# Altium schematic sheet GeneratedSystem-06.SchDoc
size 186 x 83 mm
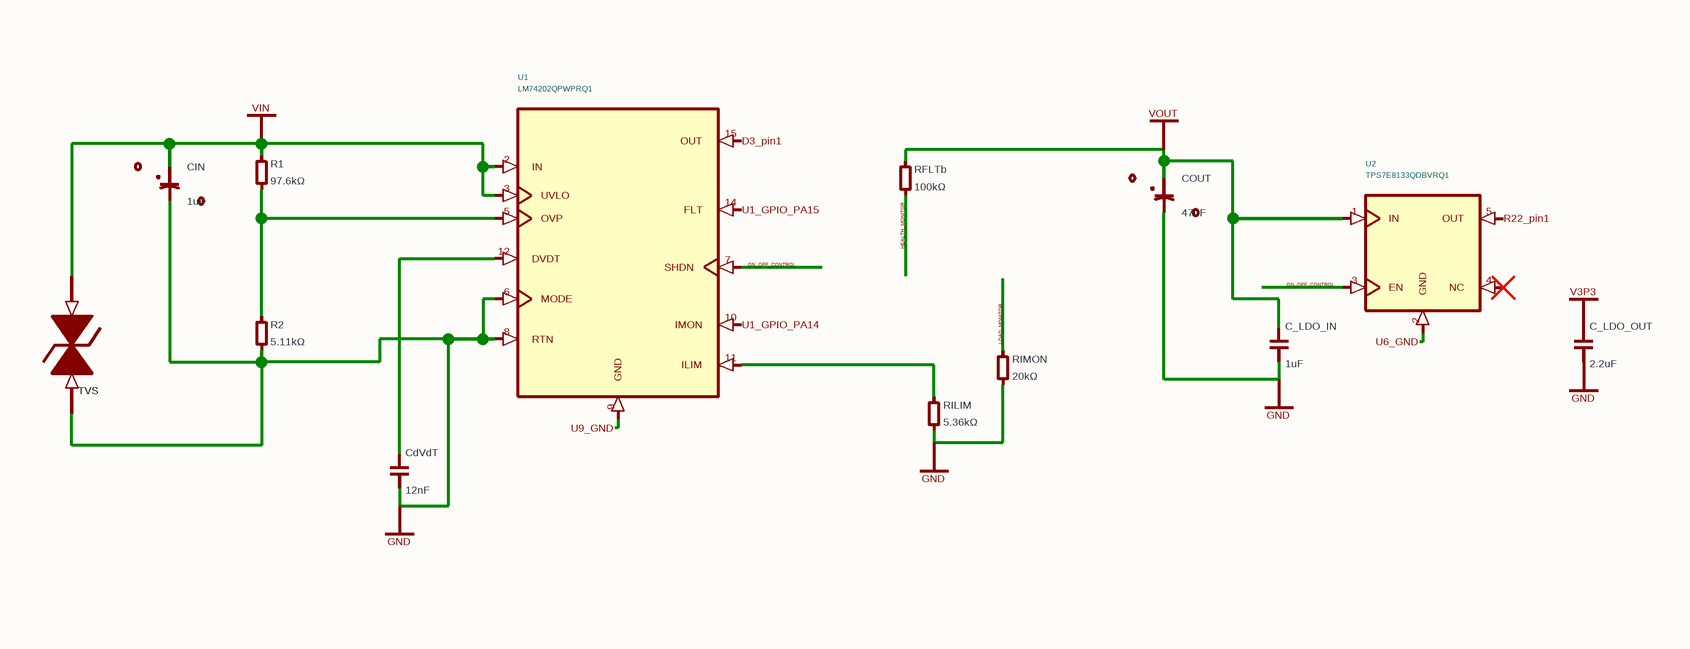
[diagram p0: GeneratedSystem-06.SchDoc]

## Parts
C_LDO_IN  1uF
C_LDO_OUT  2.2uF
CdVdT  12nF
CIN  1uF
COUT  47uF
R1  97.6kΩ
R2  5.11kΩ
RFLTb  100kΩ
RILIM  5.36kΩ
RIMON  20kΩ
TVS  (no value)
U1  (no value)
U2  (no value)

## Nets
GND: C_LDO_IN.2(cathode) C_LDO_OUT.2(cathode) CdVdT.2(cathode) CIN.2(neg) COUT.2(neg) R2.2(cathode) RILIM.2(cathode) RIMON.2(cathode) TVS.1(pin1) U1.6(MODE) U1.8(RTN)
V3P3: C_LDO_OUT.1(anode)
VIN: CIN.1(pos) R1.1(anode) TVS.2(pin2) U1.2(IN) U1.3(UVLO)
VOUT: C_LDO_IN.1(anode) COUT.1(pos) RFLTb.1(anode) U2.1(IN)
D3_pin1: U1.15(OUT)
R22_pin1: U2.5(OUT)
U1_GPIO_PA14: U1.10(IMON)
U1_GPIO_PA15: U1.14(FLT)
U6_GND: U2.2(GND)
U9_GND: U1.9(GND)
NetCdVdT_1: CdVdT.1(anode) U1.12(DVDT)
NetR1_2: R1.2(cathode) R2.1(anode) U1.5(OVP)
NetRILIM_1: RILIM.1(anode) U1.11(ILIM)

Not connected (* = marked no-connect by the designer): RFLTb 2(cathode); RIMON 1(anode); U1 7(SHDN); U2 3(EN) 4(NC)*

## Notes on the sheet
- (near U1) ON_OFF_CONTROL
- (near RFLTb) HEALTH_MONITOR
- (near U2) ON_OFF_CONTROL
- (near RIMON) LOAD_MONITOR
- (in symbol U1) LM74202QPWPRQ1
- (in symbol U2) TPS7E8133QDBVRQ1

## Library data of the parts
C_LDO_IN C_LDO_OUT CdVdT = capacitor_down
CIN COUT = capacitor_polarized_down
R1 R2 RFLTb RILIM RIMON = boxresistor_down
TVS = TVS
U1 = U1
U2 = U2